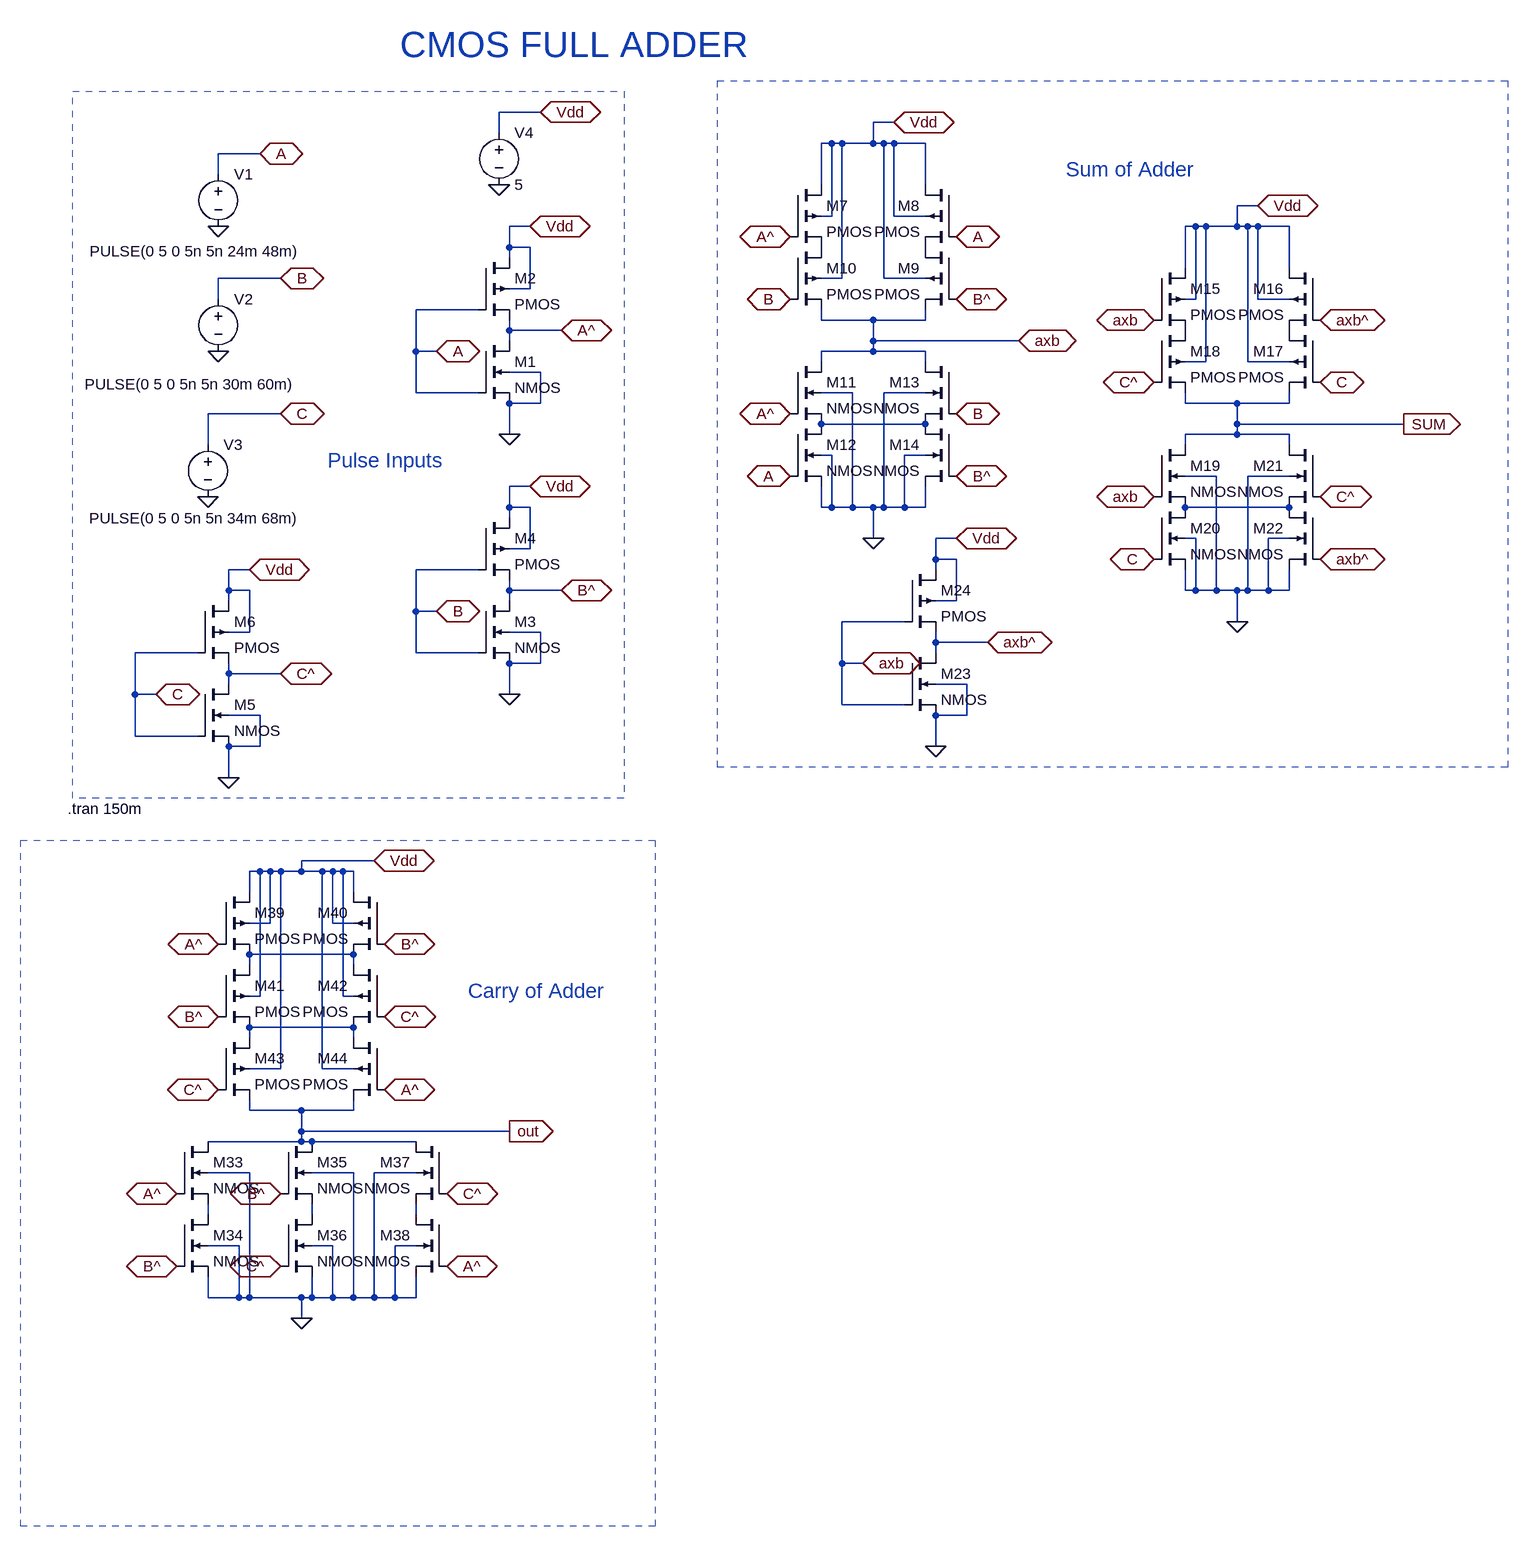
[diagram p0: schematic CMOS full ader.asc]
CMOS full ader.asc, the LTspice schematic file:
Version 4.1
SHEET 1 2676 1700
WIRE 1184 -2432 1120 -2432
WIRE 1728 -2416 1696 -2416
WIRE 1120 -2400 1120 -2432
WIRE 1632 -2384 1616 -2384
WIRE 1648 -2384 1632 -2384
WIRE 1696 -2384 1696 -2416
WIRE 1696 -2384 1648 -2384
WIRE 1712 -2384 1696 -2384
WIRE 1728 -2384 1712 -2384
WIRE 1776 -2384 1728 -2384
WIRE 752 -2368 688 -2368
WIRE 688 -2336 688 -2368
WIRE 1616 -2320 1616 -2384
WIRE 1776 -2320 1776 -2384
WIRE 2288 -2288 2256 -2288
WIRE 1632 -2272 1632 -2384
WIRE 1632 -2272 1616 -2272
WIRE 1728 -2272 1728 -2384
WIRE 1776 -2272 1728 -2272
WIRE 1168 -2256 1136 -2256
WIRE 2192 -2256 2176 -2256
WIRE 2208 -2256 2192 -2256
WIRE 2256 -2256 2256 -2288
WIRE 2256 -2256 2208 -2256
WIRE 2272 -2256 2256 -2256
WIRE 2288 -2256 2272 -2256
WIRE 2336 -2256 2288 -2256
WIRE 1136 -2224 1136 -2256
WIRE 1168 -2224 1136 -2224
WIRE 1136 -2208 1136 -2224
WIRE 2176 -2192 2176 -2256
WIRE 2336 -2192 2336 -2256
WIRE 784 -2176 688 -2176
WIRE 1648 -2176 1648 -2384
WIRE 1648 -2176 1616 -2176
WIRE 1712 -2176 1712 -2384
WIRE 1776 -2176 1712 -2176
WIRE 1168 -2160 1168 -2224
WIRE 1168 -2160 1136 -2160
WIRE 688 -2144 688 -2176
WIRE 2192 -2144 2192 -2256
WIRE 2192 -2144 2176 -2144
WIRE 2288 -2144 2288 -2256
WIRE 2336 -2144 2288 -2144
WIRE 1088 -2128 992 -2128
WIRE 1616 -2112 1616 -2128
WIRE 1696 -2112 1616 -2112
WIRE 1776 -2112 1776 -2128
WIRE 1776 -2112 1696 -2112
WIRE 1136 -2096 1136 -2112
WIRE 1216 -2096 1136 -2096
WIRE 1136 -2080 1136 -2096
WIRE 1696 -2080 1696 -2112
WIRE 1920 -2080 1696 -2080
WIRE 992 -2064 992 -2128
WIRE 1024 -2064 992 -2064
WIRE 1696 -2064 1696 -2080
WIRE 1696 -2064 1616 -2064
WIRE 1776 -2064 1696 -2064
WIRE 1616 -2048 1616 -2064
WIRE 1776 -2048 1776 -2064
WIRE 2208 -2048 2208 -2256
WIRE 2208 -2048 2176 -2048
WIRE 2272 -2048 2272 -2256
WIRE 2336 -2048 2272 -2048
WIRE 1184 -2032 1136 -2032
WIRE 992 -2000 992 -2064
WIRE 1088 -2000 992 -2000
WIRE 1664 -2000 1616 -2000
WIRE 1776 -2000 1712 -2000
WIRE 1184 -1984 1184 -2032
WIRE 1184 -1984 1136 -1984
WIRE 2176 -1984 2176 -2000
WIRE 2256 -1984 2176 -1984
WIRE 2336 -1984 2336 -2000
WIRE 2336 -1984 2256 -1984
WIRE 784 -1968 672 -1968
WIRE 1776 -1952 1616 -1952
WIRE 2256 -1952 2256 -1984
WIRE 2512 -1952 2256 -1952
WIRE 1136 -1936 1136 -1984
WIRE 2256 -1936 2256 -1952
WIRE 2256 -1936 2176 -1936
WIRE 2336 -1936 2256 -1936
WIRE 672 -1920 672 -1968
WIRE 2176 -1920 2176 -1936
WIRE 2336 -1920 2336 -1936
WIRE 1632 -1904 1616 -1904
WIRE 1776 -1904 1744 -1904
WIRE 2224 -1872 2176 -1872
WIRE 2336 -1872 2272 -1872
WIRE 1168 -1856 1136 -1856
WIRE 1136 -1824 1136 -1856
WIRE 1168 -1824 1136 -1824
WIRE 1616 -1824 1616 -1856
WIRE 1632 -1824 1632 -1904
WIRE 1632 -1824 1616 -1824
WIRE 1664 -1824 1664 -2000
WIRE 1664 -1824 1632 -1824
WIRE 1696 -1824 1664 -1824
WIRE 1712 -1824 1712 -2000
WIRE 1712 -1824 1696 -1824
WIRE 1744 -1824 1744 -1904
WIRE 1744 -1824 1712 -1824
WIRE 1776 -1824 1776 -1856
WIRE 1776 -1824 1744 -1824
WIRE 2336 -1824 2176 -1824
WIRE 1136 -1808 1136 -1824
WIRE 1696 -1776 1696 -1824
WIRE 1824 -1776 1792 -1776
WIRE 2192 -1776 2176 -1776
WIRE 2336 -1776 2304 -1776
WIRE 1168 -1760 1168 -1824
WIRE 1168 -1760 1136 -1760
WIRE 1792 -1744 1792 -1776
WIRE 1824 -1744 1792 -1744
WIRE 736 -1728 704 -1728
WIRE 1088 -1728 992 -1728
WIRE 1792 -1728 1792 -1744
WIRE 704 -1696 704 -1728
WIRE 736 -1696 704 -1696
WIRE 1136 -1696 1136 -1712
WIRE 1216 -1696 1136 -1696
WIRE 2176 -1696 2176 -1728
WIRE 2192 -1696 2192 -1776
WIRE 2192 -1696 2176 -1696
WIRE 2224 -1696 2224 -1872
WIRE 2224 -1696 2192 -1696
WIRE 2256 -1696 2224 -1696
WIRE 2272 -1696 2272 -1872
WIRE 2272 -1696 2256 -1696
WIRE 2304 -1696 2304 -1776
WIRE 2304 -1696 2272 -1696
WIRE 2336 -1696 2336 -1728
WIRE 2336 -1696 2304 -1696
WIRE 704 -1680 704 -1696
WIRE 1136 -1680 1136 -1696
WIRE 1824 -1680 1824 -1744
WIRE 1824 -1680 1792 -1680
WIRE 992 -1664 992 -1728
WIRE 1024 -1664 992 -1664
WIRE 1744 -1648 1648 -1648
WIRE 2256 -1648 2256 -1696
WIRE 736 -1632 736 -1696
WIRE 736 -1632 704 -1632
WIRE 1184 -1632 1136 -1632
WIRE 1792 -1616 1792 -1632
WIRE 1872 -1616 1792 -1616
WIRE 656 -1600 560 -1600
WIRE 992 -1600 992 -1664
WIRE 1088 -1600 992 -1600
WIRE 1792 -1600 1792 -1616
WIRE 1184 -1584 1184 -1632
WIRE 1184 -1584 1136 -1584
WIRE 1648 -1584 1648 -1648
WIRE 1680 -1584 1648 -1584
WIRE 704 -1568 704 -1584
WIRE 784 -1568 704 -1568
WIRE 704 -1552 704 -1568
WIRE 1840 -1552 1792 -1552
WIRE 560 -1536 560 -1600
WIRE 592 -1536 560 -1536
WIRE 1136 -1536 1136 -1584
WIRE 1648 -1520 1648 -1584
WIRE 1744 -1520 1648 -1520
WIRE 752 -1504 704 -1504
WIRE 1840 -1504 1840 -1552
WIRE 1840 -1504 1792 -1504
WIRE 560 -1472 560 -1536
WIRE 656 -1472 560 -1472
WIRE 752 -1456 752 -1504
WIRE 752 -1456 704 -1456
WIRE 1792 -1456 1792 -1504
WIRE 704 -1408 704 -1456
WIRE 928 -1280 816 -1280
WIRE 752 -1264 736 -1264
WIRE 768 -1264 752 -1264
WIRE 784 -1264 768 -1264
WIRE 816 -1264 816 -1280
WIRE 816 -1264 784 -1264
WIRE 848 -1264 816 -1264
WIRE 864 -1264 848 -1264
WIRE 880 -1264 864 -1264
WIRE 896 -1264 880 -1264
WIRE 736 -1232 736 -1264
WIRE 896 -1232 896 -1264
WIRE 768 -1184 768 -1264
WIRE 768 -1184 736 -1184
WIRE 864 -1184 864 -1264
WIRE 896 -1184 864 -1184
WIRE 896 -1136 736 -1136
WIRE 736 -1120 736 -1136
WIRE 896 -1120 896 -1136
WIRE 752 -1072 752 -1264
WIRE 752 -1072 736 -1072
WIRE 880 -1072 880 -1264
WIRE 896 -1072 880 -1072
WIRE 896 -1024 736 -1024
WIRE 736 -1008 736 -1024
WIRE 896 -1008 896 -1024
WIRE 784 -960 784 -1264
WIRE 784 -960 736 -960
WIRE 848 -960 848 -1264
WIRE 896 -960 848 -960
WIRE 736 -896 736 -912
WIRE 816 -896 736 -896
WIRE 896 -896 896 -912
WIRE 896 -896 816 -896
WIRE 816 -864 816 -896
WIRE 1136 -864 816 -864
WIRE 816 -848 816 -864
WIRE 816 -848 672 -848
WIRE 832 -848 816 -848
WIRE 992 -848 832 -848
WIRE 736 -800 672 -800
WIRE 896 -800 832 -800
WIRE 992 -800 928 -800
WIRE 672 -736 672 -752
WIRE 832 -736 832 -752
WIRE 992 -736 992 -752
WIRE 720 -688 672 -688
WIRE 864 -688 832 -688
WIRE 992 -688 960 -688
WIRE 672 -608 672 -640
WIRE 720 -608 720 -688
WIRE 720 -608 672 -608
WIRE 736 -608 736 -800
WIRE 736 -608 720 -608
WIRE 816 -608 736 -608
WIRE 832 -608 832 -640
WIRE 832 -608 816 -608
WIRE 864 -608 864 -688
WIRE 864 -608 832 -608
WIRE 896 -608 896 -800
WIRE 896 -608 864 -608
WIRE 928 -608 928 -800
WIRE 928 -608 896 -608
WIRE 960 -608 960 -688
WIRE 960 -608 928 -608
WIRE 992 -608 992 -640
WIRE 992 -608 960 -608
WIRE 816 -576 816 -608
FLAG 688 -2256 0
FLAG 688 -2064 0
FLAG 672 -1840 0
FLAG 1120 -2320 0
FLAG 752 -2368 A
IOPIN 752 -2368 BiDir
FLAG 784 -2176 B
IOPIN 784 -2176 BiDir
FLAG 784 -1968 C
IOPIN 784 -1968 BiDir
FLAG 1184 -2432 Vdd
IOPIN 1184 -2432 BiDir
FLAG 1136 -1936 0
FLAG 1168 -2256 Vdd
IOPIN 1168 -2256 BiDir
FLAG 1024 -2064 A
IOPIN 1024 -2064 BiDir
FLAG 1216 -2096 A^
IOPIN 1216 -2096 BiDir
FLAG 1136 -1536 0
FLAG 1168 -1856 Vdd
IOPIN 1168 -1856 BiDir
FLAG 1024 -1664 B
IOPIN 1024 -1664 BiDir
FLAG 1216 -1696 B^
IOPIN 1216 -1696 BiDir
FLAG 704 -1408 0
FLAG 736 -1728 Vdd
IOPIN 736 -1728 BiDir
FLAG 592 -1536 C
IOPIN 592 -1536 BiDir
FLAG 784 -1568 C^
IOPIN 784 -1568 BiDir
FLAG 1696 -1776 0
FLAG 1728 -2416 Vdd
IOPIN 1728 -2416 BiDir
FLAG 1824 -1872 B^
IOPIN 1824 -1872 BiDir
FLAG 1824 -1968 B
IOPIN 1824 -1968 BiDir
FLAG 1824 -2144 B^
IOPIN 1824 -2144 BiDir
FLAG 1824 -2240 A
IOPIN 1824 -2240 BiDir
FLAG 1568 -2240 A^
IOPIN 1568 -2240 BiDir
FLAG 1568 -2144 B
IOPIN 1568 -2144 BiDir
FLAG 1568 -1968 A^
IOPIN 1568 -1968 BiDir
FLAG 1568 -1872 A
IOPIN 1568 -1872 BiDir
FLAG 2256 -1648 0
FLAG 2288 -2288 Vdd
IOPIN 2288 -2288 BiDir
FLAG 2128 -1840 axb
IOPIN 2128 -1840 BiDir
FLAG 2384 -1744 axb^
IOPIN 2384 -1744 BiDir
FLAG 2128 -2112 axb
IOPIN 2128 -2112 BiDir
FLAG 2128 -2016 C^
IOPIN 2128 -2016 BiDir
FLAG 2384 -2016 C
IOPIN 2384 -2016 BiDir
FLAG 2384 -2112 axb^
IOPIN 2384 -2112 BiDir
FLAG 2128 -1744 C
IOPIN 2128 -1744 BiDir
FLAG 2384 -1840 C^
IOPIN 2384 -1840 BiDir
FLAG 1920 -2080 axb
IOPIN 1920 -2080 BiDir
FLAG 1792 -1456 0
FLAG 1824 -1776 Vdd
IOPIN 1824 -1776 BiDir
FLAG 1680 -1584 axb
IOPIN 1680 -1584 BiDir
FLAG 1872 -1616 axb^
IOPIN 1872 -1616 BiDir
FLAG 2512 -1952 SUM
IOPIN 2512 -1952 Out
FLAG 1136 -864 out
IOPIN 1136 -864 Out
FLAG 928 -1280 Vdd
IOPIN 928 -1280 BiDir
FLAG 944 -1152 B^
IOPIN 944 -1152 BiDir
FLAG 944 -1040 C^
IOPIN 944 -1040 BiDir
FLAG 944 -928 A^
IOPIN 944 -928 BiDir
FLAG 688 -928 C^
IOPIN 688 -928 BiDir
FLAG 688 -1040 B^
IOPIN 688 -1040 BiDir
FLAG 688 -1152 A^
IOPIN 688 -1152 BiDir
FLAG 624 -768 A^
IOPIN 624 -768 BiDir
FLAG 624 -656 B^
IOPIN 624 -656 BiDir
FLAG 784 -768 B^
IOPIN 784 -768 BiDir
FLAG 784 -656 C^
IOPIN 784 -656 BiDir
FLAG 1040 -768 C^
IOPIN 1040 -768 BiDir
FLAG 1040 -656 A^
IOPIN 1040 -656 BiDir
FLAG 816 -576 0
SYMBOL voltage 688 -2352 R0
WINDOW 3 -198 134 Left 2
WINDOW 123 0 0 Left 0
WINDOW 39 0 0 Left 0
SYMATTR Value PULSE(0 5 0 5n 5n 24m 48m)
SYMATTR InstName V1
SYMBOL voltage 688 -2160 R0
WINDOW 3 -206 147 Left 2
WINDOW 123 0 0 Left 0
WINDOW 39 0 0 Left 0
SYMATTR Value PULSE(0 5 0 5n 5n 30m 60m)
SYMATTR InstName V2
SYMBOL voltage 672 -1936 R0
WINDOW 3 -183 129 Left 2
WINDOW 123 0 0 Left 0
WINDOW 39 0 0 Left 0
SYMATTR Value PULSE(0 5 0 5n 5n 34m 68m)
SYMATTR InstName V3
SYMBOL voltage 1120 -2416 R0
WINDOW 123 0 0 Left 0
WINDOW 39 0 0 Left 0
SYMATTR InstName V4
SYMATTR Value 5
SYMBOL nmos4 1088 -2080 R0
SYMATTR InstName M1
SYMBOL pmos4 1088 -2208 R0
SYMATTR InstName M2
SYMBOL nmos4 1088 -1680 R0
SYMATTR InstName M3
SYMBOL pmos4 1088 -1808 R0
SYMATTR InstName M4
SYMBOL nmos4 656 -1552 R0
SYMATTR InstName M5
SYMBOL pmos4 656 -1680 R0
SYMATTR InstName M6
SYMBOL pmos4 1568 -2320 R0
SYMATTR InstName M7
SYMBOL pmos4 1824 -2320 M0
SYMATTR InstName M8
SYMBOL pmos4 1824 -2224 M0
SYMATTR InstName M9
SYMBOL pmos4 1568 -2224 R0
SYMATTR InstName M10
SYMBOL nmos4 1568 -2048 R0
SYMATTR InstName M11
SYMBOL nmos4 1568 -1952 R0
SYMATTR InstName M12
SYMBOL nmos4 1824 -2048 M0
SYMATTR InstName M13
SYMBOL nmos4 1824 -1952 M0
SYMATTR InstName M14
SYMBOL pmos4 2128 -2192 R0
SYMATTR InstName M15
SYMBOL pmos4 2384 -2192 M0
SYMATTR InstName M16
SYMBOL pmos4 2384 -2096 M0
SYMATTR InstName M17
SYMBOL pmos4 2128 -2096 R0
SYMATTR InstName M18
SYMBOL nmos4 2128 -1920 R0
SYMATTR InstName M19
SYMBOL nmos4 2128 -1824 R0
SYMATTR InstName M20
SYMBOL nmos4 2384 -1920 M0
SYMATTR InstName M21
SYMBOL nmos4 2384 -1824 M0
SYMATTR InstName M22
SYMBOL nmos4 1744 -1600 R0
SYMATTR InstName M23
SYMBOL pmos4 1744 -1728 R0
SYMATTR InstName M24
SYMBOL nmos4 624 -848 R0
SYMATTR InstName M33
SYMBOL nmos4 624 -736 R0
SYMATTR InstName M34
SYMBOL nmos4 784 -848 R0
SYMATTR InstName M35
SYMBOL nmos4 784 -736 R0
SYMATTR InstName M36
SYMBOL nmos4 1040 -848 M0
SYMATTR InstName M37
SYMBOL nmos4 1040 -736 M0
SYMATTR InstName M38
SYMBOL pmos4 688 -1232 R0
SYMATTR InstName M39
SYMBOL pmos4 944 -1232 M0
SYMATTR InstName M40
SYMBOL pmos4 688 -1120 R0
SYMATTR InstName M41
SYMBOL pmos4 944 -1120 M0
SYMATTR InstName M42
SYMBOL pmos4 688 -1008 R0
SYMATTR InstName M43
SYMBOL pmos4 944 -1008 M0
SYMATTR InstName M44
TEXT 968 -2536 Left 5 ;CMOS FULL ADDER
TEXT 856 -1896 Left 3 ;Pulse Inputs
TEXT 456 -1360 Left 2 !.tran 150m
TEXT 1992 -2344 Left 3 ;Sum of Adder
TEXT 1072 -1080 Left 3 ;Carry of Adder
RECTANGLE Normal 1312 -1376 464 -2464 2
RECTANGLE Normal 2672 -1424 1456 -2480 3
RECTANGLE Normal 1360 -256 384 -1312 3

The netlist it stands for:
* CMOS full ader.asc
V1 A 0 PULSE(0 5 0 5n 5n 24m 48m)
V2 B 0 PULSE(0 5 0 5n 5n 30m 60m)
V3 C 0 PULSE(0 5 0 5n 5n 34m 68m)
V4 Vdd 0 5
M1 A^ A 0 0 NMOS
M2 Vdd A A^ Vdd PMOS
M3 B^ B 0 0 NMOS
M4 Vdd B B^ Vdd PMOS
M5 C^ C 0 0 NMOS
M6 Vdd C C^ Vdd PMOS
M7 Vdd A^ P001 Vdd PMOS
M8 Vdd A P002 Vdd PMOS
M9 P002 B^ axb Vdd PMOS
M10 P001 B axb Vdd PMOS
M11 axb A^ N001 0 NMOS
M12 N001 A 0 0 NMOS
M13 axb B N001 0 NMOS
M14 N001 B^ 0 0 NMOS
M15 Vdd axb P003 Vdd PMOS
M16 Vdd axb^ P004 Vdd PMOS
M17 P004 C SUM Vdd PMOS
M18 P003 C^ SUM Vdd PMOS
M19 SUM axb N002 0 NMOS
M20 N002 C 0 0 NMOS
M21 SUM C^ N002 0 NMOS
M22 N002 axb^ 0 0 NMOS
M23 axb^ axb 0 0 NMOS
M24 Vdd axb axb^ Vdd PMOS
M33 out A^ N005 0 NMOS
M34 N005 B^ 0 0 NMOS
M35 out B^ N006 0 NMOS
M36 N006 C^ 0 0 NMOS
M37 out C^ N007 0 NMOS
M38 N007 A^ 0 0 NMOS
M39 Vdd A^ N003 Vdd PMOS
M40 Vdd B^ N003 Vdd PMOS
M41 N003 B^ N004 Vdd PMOS
M42 N003 C^ N004 Vdd PMOS
M43 N004 C^ out Vdd PMOS
M44 N004 A^ out Vdd PMOS
.model NMOS NMOS
.model PMOS PMOS
.lib standard.mos
* CMOS FULL ADDER
* Pulse Inputs
.tran 150m
* Sum of Adder
* Carry of Adder
.backanno
.end